# Altium schematic sheet the-bicho.SchDoc: The Bicho
size A4
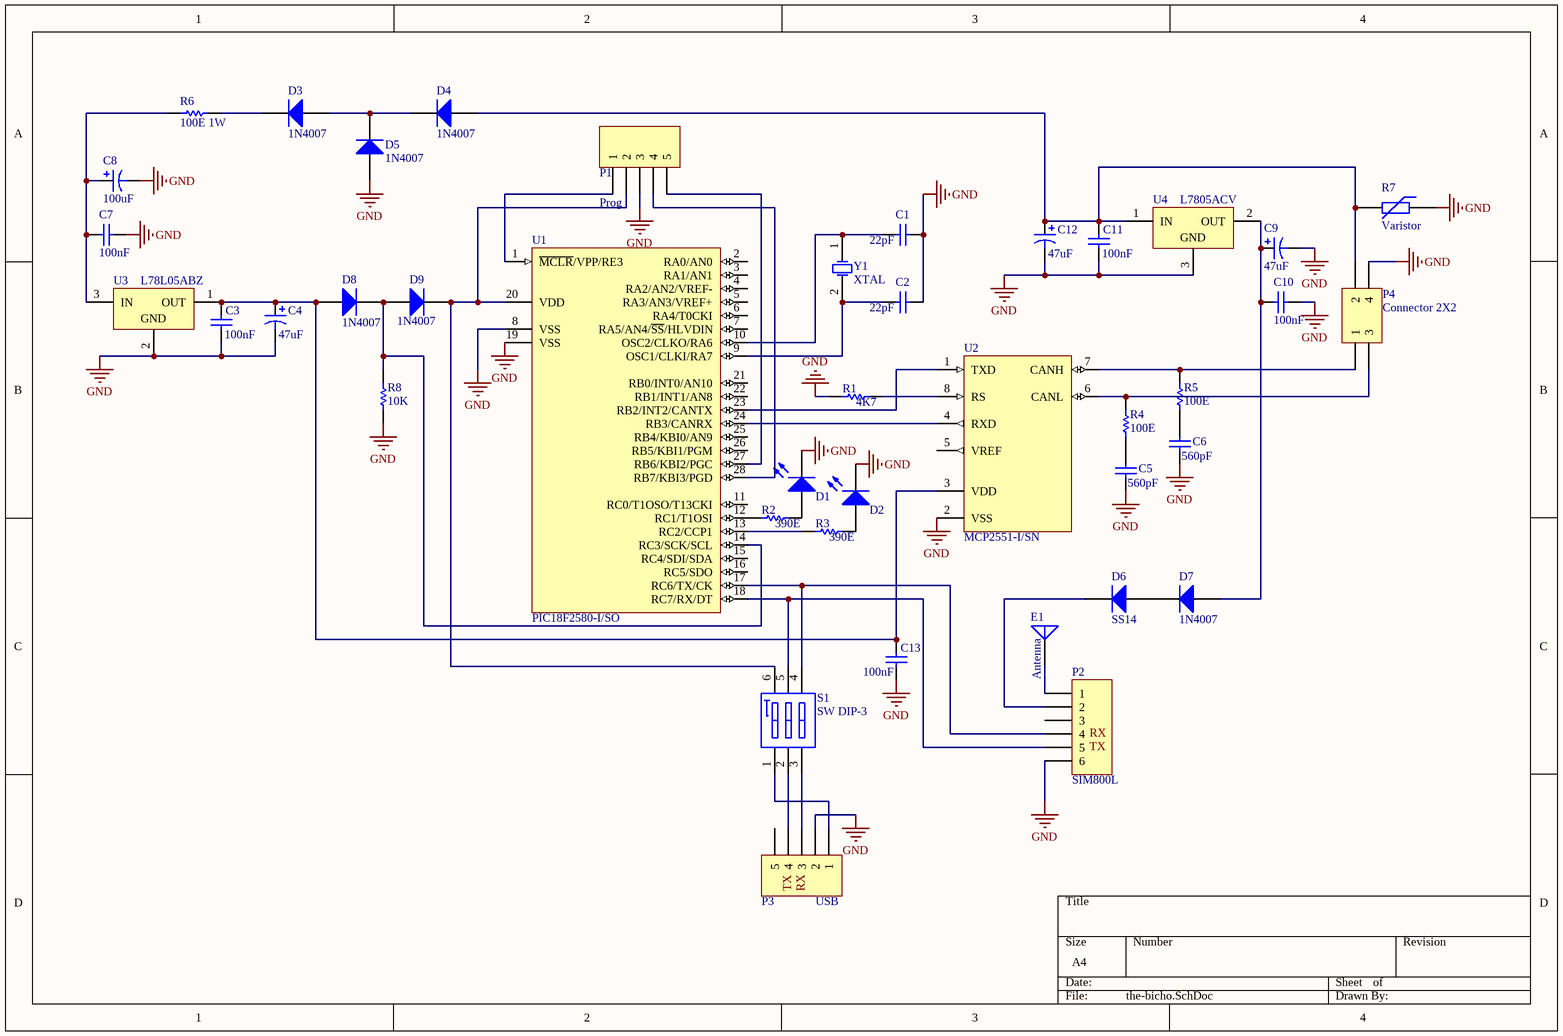
[diagram p0: the-bicho.SchDoc]

## Parts
C1  value 22pF  [PCBComponent_1]
C2  value 22pF  [PCBComponent_1]
C3  value 100nF  [PCBComponent_1]
C4  value 47uF  [PCBComponent_1]
C5  value 560pF  [PCBComponent_1]
C6  value 560pF  [PCBComponent_1]
C7  value 100nF  [PCBComponent_1]
C8  value 100uF  [PCBComponent_1]
C9  value 47uF  [PCBComponent_1]
C10  value 100nF  [PCBComponent_1]
C11  value 100nF  [PCBComponent_1]
C12  value 47uF  [PCBComponent_1]
C13  value 100nF  [PCBComponent_1]
D1  (no value)  [PCBComponent_1]
D2  (no value)  [PCBComponent_1]
D3  1N4007  [PCBComponent_1]
D4  1N4007  [PCBComponent_1]
D5  1N4007  [PCBComponent_1]
D6  SS14  [PCBComponent_1]
D7  1N4007  [PCBComponent_1]
D8  1N4007  [PCBComponent_1]
D9  1N4007  [PCBComponent_1]
E1  Antenna  [PIN1]
P1  Prog  [HDR1X5]
P2  SIM800L  [HDR1X6]
P3  USB  [HDR1X5]
P4  Connector 2X2  [PCBComponent_1]
R1  value 4K7  [PCBComponent_1]
R2  value 390E  [PCBComponent_1]
R3  value 390E  [PCBComponent_1]
R4  value 100E  [PCBComponent_1]
R5  value 100E  [PCBComponent_1]
R6  value 100E 1W  [PCBComponent_1]
R7  Varistor  [PCBComponent_1]
R8  value 10K  [PCBComponent_1]
S1  SW DIP-3  [PCBComponent_1]
U1  PIC18F2580-I/SO  [SOIC-SO28_N]
U2  MCP2551-I/SN  [SOIC-SN8_N]
U3  L78L05ABZ  [PCBComponent_1]
U4  L7805ACV  [TO220ABN]
Y1  XTAL  [PCBComponent_1]

## Nets
GND: C1.2 C2.2 C3.1 C4.2 C5.1 C6.1 C7.1 C8.2 C9.2 C10.1 C11.1 C12.2 C13.1 D1.2(K) D2.2(K) D5.1(A) P1.3 P2.6 P3.2 P4.4 R1.1 R7.1 R8.1 U1.8(VSS) U1.19(VSS) U2.2(VSS) U3.2(GND) U4.3(GND)
NetC1_1: C1.1 U1.10(OSC2/CLKO/RA6) Y1.1(OSC1)
NetC2_1: C2.1 U1.9(OSC1/CLKI/RA7) Y1.2(OSC2)
NetC3_2: C3.2 C4.1 C13.2 D8.1(A) U2.3(VDD) U3.1(OUT)
NetC5_2: C5.2 R4.1
NetC6_2: C6.2 R5.1
NetC7_2: C7.2 C8.1 R6.2 U3.3(IN)
NetC9_1: C9.1 C10.2 D7.1(A) U4.2(OUT)
NetC11_2: C11.2 C12.1 D4.1(A) P4.2 R7.2 U4.1(IN)
NetD1_1: D1.1(A) R2.2
NetD2_1: D2.1(A) R3.2
NetD3_1: D3.1(A) D4.2(K) D5.2(K)
NetD3_2: D3.2(K) R6.1
NetD6_1: D6.1(A) D7.2(K)
NetD6_2: D6.2(K) P2.2
NetD8_2: D8.2(K) D9.1(A) R8.2 U1.14(RC3/SCK/SCL)
NetD9_2: D9.2(K) P1.2 S1.6(B1) U1.20(VDD)
NetE1_1: E1.1(A) P2.1
NetP1_1: P1.1 U1.1(~{MCLR}/VPP/RE3)
NetP1_4: P1.4 U1.28(RB7/KBI3/PGD)
NetP1_5: P1.5 U1.27(RB6/KBI2/PGC)
NetP2_4: P2.4 S1.4(B3) U1.17(RC6/TX/CK)
NetP2_5: P2.5 S1.5(B2) U1.18(RC7/RX/DT)
NetP3_1: P3.1 S1.1(A1)
NetP3_3: P3.3 S1.3(A3)
NetP3_4: P3.4 S1.2(A2)
NetP4_1: P4.1 R5.2 U2.7(CANH)
NetP4_3: P4.3 R4.2 U2.6(CANL)
NetR1_2: R1.2 U2.8(RS)
NetR2_1: R2.1 U1.12(RC1/T1OSI)
NetR3_1: R3.1 U1.13(RC2/CCP1)
NetU1_23: U1.23(RB2/INT2/CANTX) U2.1(TXD)
NetU1_24: U1.24(RB3/CANRX) U2.4(RXD)

Not connected (* = marked no-connect by the designer): P2 3; P3 5; U1 2(RA0/AN0) 3(RA1/AN1) 4(RA2/AN2/VREF-) 5(RA3/AN3/VREF+) 6(RA4/T0CKI) 7(RA5/AN4/~{SS}/HLVDIN) 11(RC0/T1OSO/T13CKI) 15(RC4/SDI/SDA) 16(RC5/SDO) 21(RB0/INT0/AN10) 22(RB1/INT1/AN8) 25(RB4/KBI0/AN9) 26(RB5/KBI1/PGM); U2 5(VREF)

## Notes on the sheet
- Labels drawn without touching a wire or pin: RX, TX

## Library data of the parts
C1-C3 C5-C7 C10 C11 C13 = Cap: Capacitor; Published: 8-Jun-2000; LatestRevisionDate: 17-Jul-2002; LatestRevisionNote: Re-released for DXP Platform.; PackageReference: RAD-0.3; Publisher: Altium Limited
C4 C8 C9 C12 = Cap Pol1: Polarized Capacitor (Radial); Published: 8-Jun-2000; LatestRevisionDate: 17-Jul-2002; LatestRevisionNote: Re-released for DXP Platform.; PackageReference: RB7.6-15; Publisher: Altium Limited
D1 D2 = LED0: Typical INFRARED GaAs LED; Published: 8-Jun-2000; LatestRevisionDate: 08-Jul-2005; LatestRevisionNote: Mech Layer 1 removed.; PackageReference: LED-0; Publisher: Altium Limited
D3-D9 = Diode 1N4007: 1 Amp General Purpose Rectifier; Published: 8-Jun-2000; LatestRevisionDate: 17-Jul-2002; LatestRevisionNote: Re-released for DXP Platform.; DatasheetVersion: 1998; PackageVersion: Aug-1999; PackageReference: DO-41; Publisher: Altium Limited; Code_JEDEC: DO-204-AL; ComponentLink1Description: Manufacturer Link; ComponentLink1URL: http://www.fairchildsemi.com/; ComponentLink2Description: Datasheet; ComponentLink2URL: http://www.fairchildsemi.com/ds/1N%2F1N4001.pdf
E1 = Antenna: Generic Antenna; Published: 24-Mar-1999; LatestRevisionDate: 17-Jul-2002; LatestRevisionNote: Re-released for DXP Platform.; PackageReference: PIN1; Publisher: Altium Limited
P1 P3 = Header 5: Header, 5-Pin; LatestRevisionDate: 17-Jul-2002; LatestRevisionNote: Re-released for DXP Platform.; Publisher: Altium Limited
P2 = Header 6: Header, 6-Pin; LatestRevisionDate: 17-Jul-2002; LatestRevisionNote: Re-released for DXP Platform.; Publisher: Altium Limited
P4 = Header 2X2: Header, 2-Pin, Dual row; LatestRevisionDate: 17-Jul-2002; LatestRevisionNote: Re-released for DXP Platform.; Publisher: Altium Limited
R1-R6 R8 = Res1: Resistor; Published: 8-Jun-2000; LatestRevisionDate: 17-Jul-2002; LatestRevisionNote: Re-released for DXP Platform.; PackageReference: AXIAL-0.3; Publisher: Altium Limited
R7 = Res Varistor: Varistor (Voltage-Sensitive Resistor); Published: 24-Mar-1999; LatestRevisionDate: 29-May-2009; LatestRevisionNote: IPC-7351 Footprint Added.; PackageVersion: Mar-2003; PackageReference: 6-0805; Publisher: Altium Limited; PackageDescription: Chip Resistor 0805 Case Size; Code_IPC: RESC2012
S1 = SW DIP-3: DIP Switch, 3 Position, SPST; Published: 24-Mar-1999; LatestRevisionDate: 17-Jul-2002; LatestRevisionNote: Re-released for DXP Platform.; PackageReference: DIP-6; Publisher: Altium Limited; Code_JEDEC: MO-001-AM
U1 = PIC18F2580-I/SO: Enhanced Flash Microcontroller with ECAN Technology, 10-Bit A/D and nanoWatt Technology, 32K Flash, 28-Pin SOIC, Industrial Temperature Range; Published: 29-Jan-2009; LatestRevisionDate: 02-Dec-2009; LatestRevisionNote: Updated to datasheet revision D, Nov-2009; DatasheetVersion: revD, Nov-2009; PackageVersion: revBB, Aug-2009; PackageReference: SOIC-SO28; Publisher: Altium Limited; PackageDescription: 28-Lead Plastic Small Outline (SO) - Wide 7.50mm Body [SOIC]; Supplier 1: Digi-Key; Supplier Part Number 1: PIC18F2580-I/SO-ND; Supplier 2: Farnell; Supplier Part Number 2: 9321284; Supplier 3: Farnell; Supplier Part Number 3: 1660054; Code_JEDEC: MS-013; ComponentLink1Description: Datasheet; ComponentLink1URL: http://ww1.microchip.com/downloads/en/DeviceDoc/39637d.pdf; ComponentLink2Description: Packaging Specification; ComponentLink2URL: http://www.microchip.com/stellent/groups/techpub_sg/documents/packagingspec/en012702.pdf; ComponentLink3Description: Microchip.com Home; ComponentLink3URL: http://www.microchip.com/
U2 = MCP2551-I/SN: High-Speed CAN Transceiver, 8-Pin SOIC, Industrial Temperature; Published: 29-Jan-2009; DatasheetVersion: revE, Jan-2007; PackageVersion: revBB, Aug-2009; PackageReference: SOIC-SN8; Publisher: Altium Limited; PackageDescription: 8-Lead Plastic Small Outline (SN) - Narrow, 3.90mm Body [SOIC]; Supplier 1: Digi-Key; Supplier Part Number 1: MCP2551-I/SN-ND; Supplier 2: Farnell; Supplier Part Number 2: 9758569; Code_JEDEC: MS-012; Code_IPC: SOIC127P600-8; ComponentLink1Description: Datasheet; ComponentLink1URL: http://ww1.microchip.com/downloads/en/DeviceDoc/21667E.pdf; ComponentLink2Description: Packaging Specification; ComponentLink2URL: http://www.microchip.com/stellent/groups/techpub_sg/documents/packagingspec/en012702.pdf; ComponentLink3Description: Microchip.com Home; ComponentLink3URL: http://www.microchip.com/
U3 = L78L05ABZ: Positive Voltage Regulator; Published: 24-Aug-2001; LatestRevisionDate: 17-Jul-2002; LatestRevisionNote: Re-released for DXP Platform.; DatasheetVersion: Feb-1999; PackageReference: TO92; Publisher: Altium Limited; PackageDescription: TO, Flat Index; 3 In-Line, Axial Leads; Body Dia. 4.8mm; Leads 0.51 x 0.51 mm (max); ComponentLink1Description: Manufacturer Link; ComponentLink1URL: http://www.st.com/
U4 = L7805ACV: Precision 1A Regulator; Note: Tab is connected to pin 3 (GND).; Published: 24-Aug-2001; LatestRevisionDate: 17-Jul-2002; LatestRevisionNote: Re-released for DXP Platform.; DatasheetVersion: Nov-1999; PackageVersion: Jun-1998; PackageReference: TO220ABN; Publisher: Altium Limited; PackageDescription: TO, Thru-Hole, Vertical, Heatsink Mounted; 3 In-Line Leads; Pitch 2.54 mm; Pin sequence 1, 3, 2; ComponentLink1Description: Manufacturer Link; ComponentLink1URL: http://www.st.com/; ComponentLink2Description: Datasheet; ComponentLink2URL: http://www.st.com/stonline/products/literature/ds/2144/l7805ab.pdf
Y1 = XTAL: Crystal Oscillator; Published: 8-Jun-2000; LatestRevisionDate: 17-Jul-2002; LatestRevisionNote: Re-released for DXP Platform.; PackageReference: R38; Publisher: Altium Limited